# Altium project Phased_Array_Project.PrjPcb
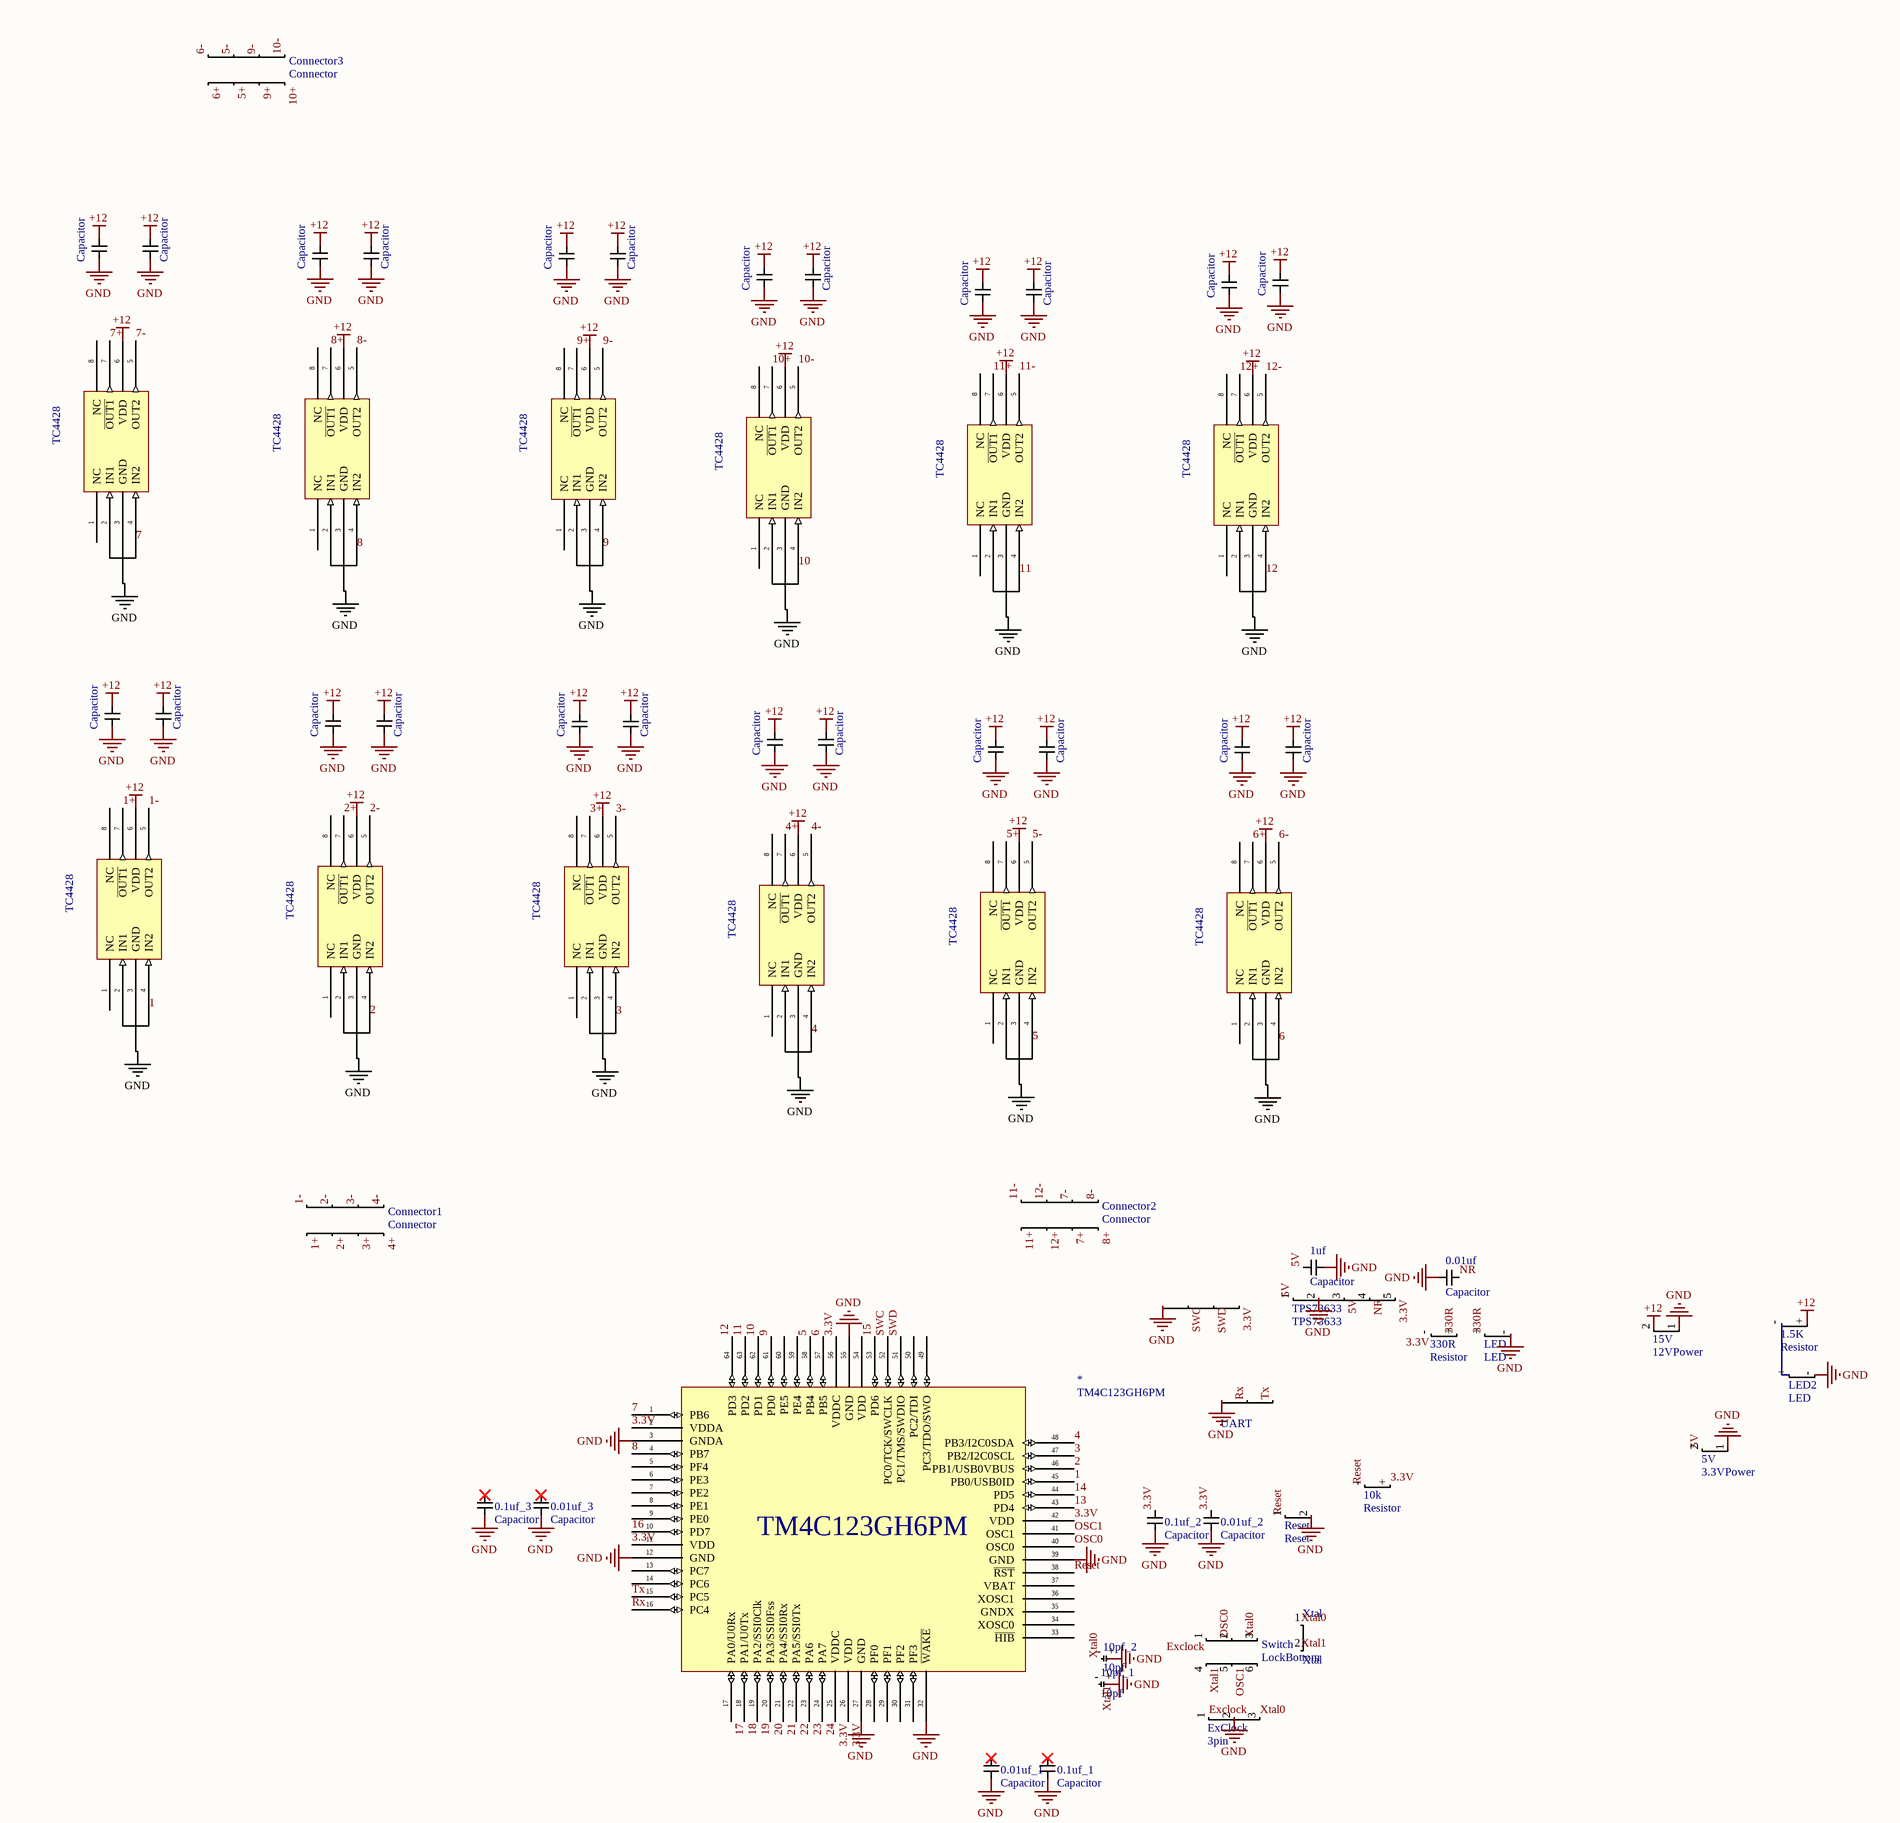
[diagram p0: Final Design.SchDoc, top]
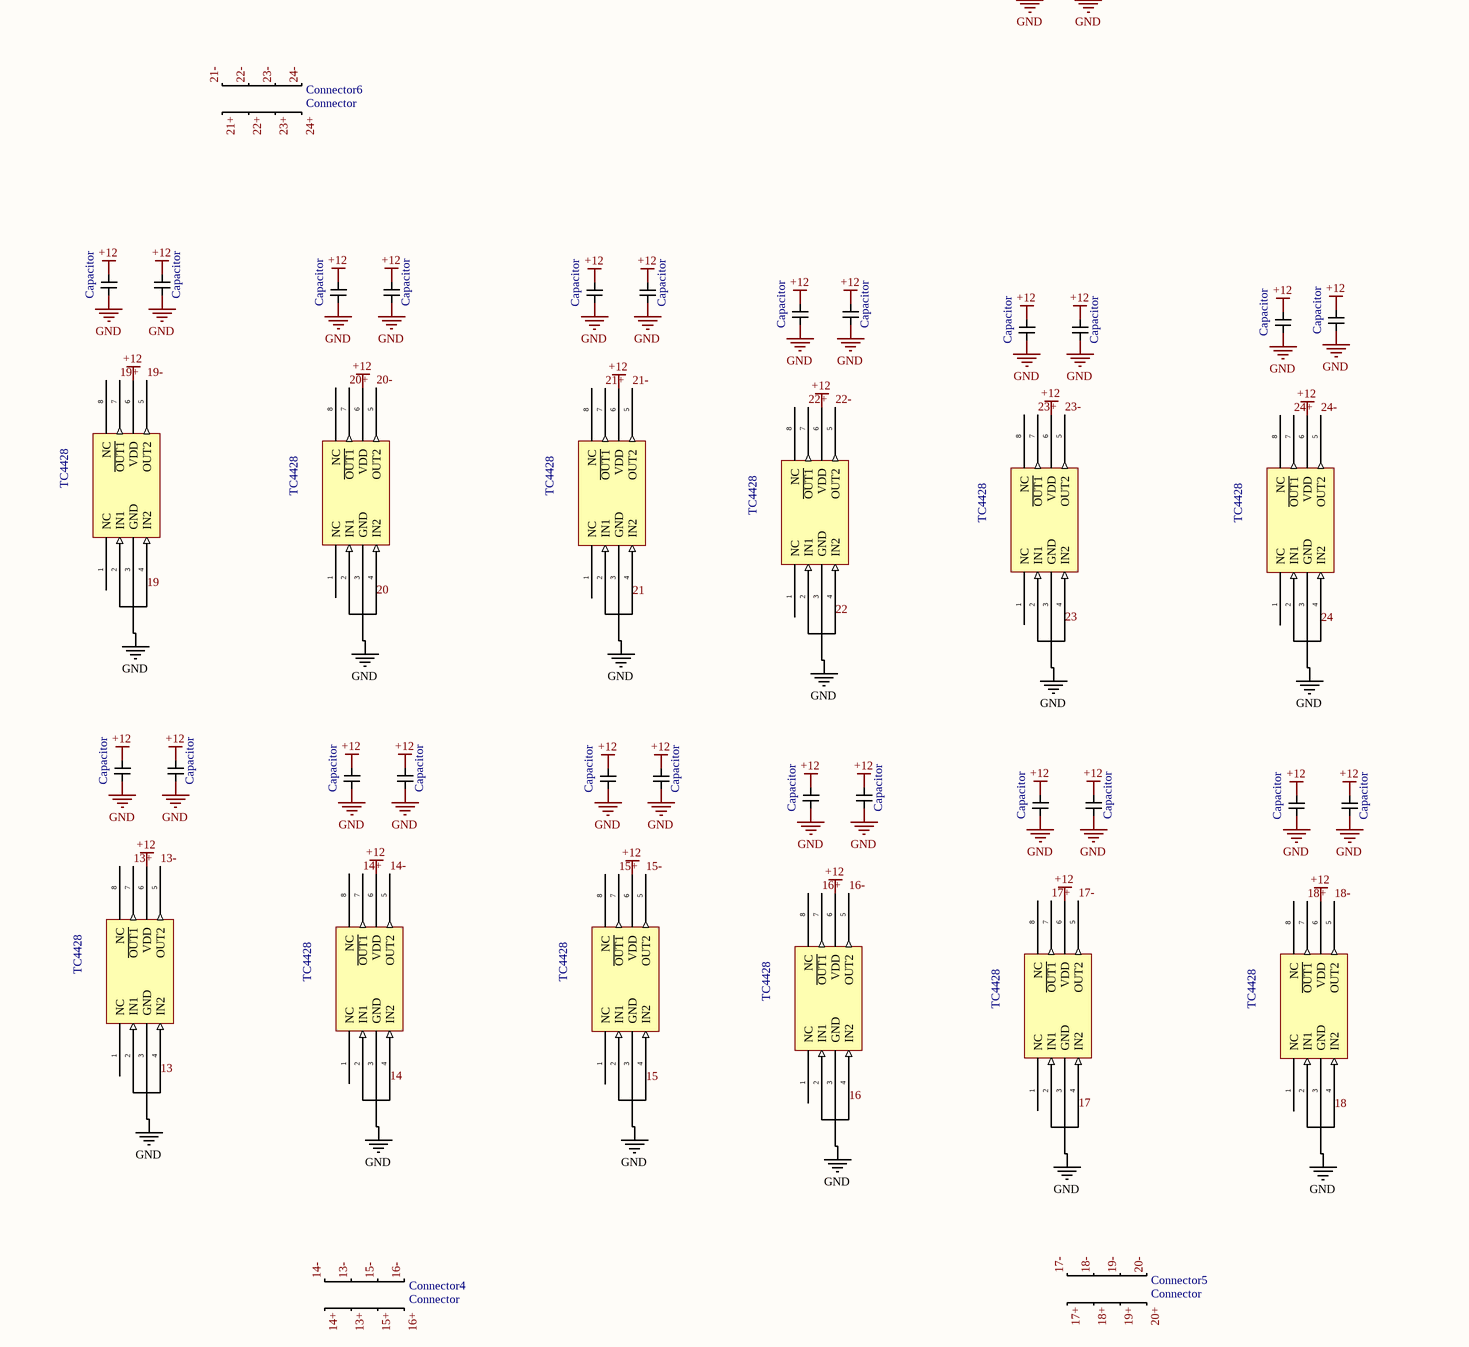
[diagram p1: Final Design.SchDoc, bottom]
1 sheet, 103 parts. Net scope: global (net labels, ports and power ports of the same name join across sheets).
Board file: PCB1.PcbDoc

## Sheet Final Design.SchDoc
size A0; Organization: Altium Limited; Address1: L3, 12a Rodborough Rd; Address2: Frenchs Forest; Address3: NSW; Address4: Australia 2086

### Parts
0.01uf  Capacitor  [0805]
0.01uf_1  Capacitor  [0805]
0.1uf_1  Capacitor  [0805]
0.1uf_2  Capacitor  [0805]
0.01uf_2  Capacitor  [0805]
0.1uf_3  Capacitor  [0805]
0.01uf_3  Capacitor  [0805]
1  TC4428  [TC4428SOC]
1.1  Capacitor  [0805]
1.2  Capacitor  [0805]
1.5K  Resistor  [0805]
1uf  Capacitor  [0805]
2  TC4428  [TC4428SOC]
2.1  Capacitor  [0805]
2.2  Capacitor  [0805]
3  TC4428  [TC4428SOC]
3.1  Capacitor  [0805]
3.2  Capacitor  [0805]
4  TC4428  [TC4428SOC]
4.1  Capacitor  [0805]
4.2  Capacitor  [0805]
5  TC4428  [TC4428SOC]
5.1  Capacitor  [0805]
5.2  Capacitor  [0805]
5V  3.3VPower  [DIP10]
6  TC4428  [TC4428SOC]
6.1  Capacitor  [0805]
6.2  Capacitor  [0805]
7  TC4428  [TC4428SOC]
7.1  Capacitor  [0805]
7.2  Capacitor  [0805]
8  TC4428  [TC4428SOC]
8.1  Capacitor  [0805]
8.2  Capacitor  [0805]
9  TC4428  [TC4428SOC]
9.1  Capacitor  [0805]
9.2  Capacitor  [0805]
10  TC4428  [TC4428SOC]
10.1  Capacitor  [0805]
10.2  Capacitor  [0805]
10k  Resistor  [0805]
10pf_1  10pf  [10pf]
10pf_2  10pf  [10pf]
11  TC4428  [TC4428SOC]
11.1  Capacitor  [0805]
11.2  Capacitor  [0805]
12  TC4428  [TC4428SOC]
12.1  Capacitor  [0805]
12.2  Capacitor  [0805]
13  TC4428  [TC4428SOC]
13.1  Capacitor  [0805]
13.2  Capacitor  [0805]
14  TC4428  [TC4428SOC]
14.1  Capacitor  [0805]
14.2  Capacitor  [0805]
15  TC4428  [TC4428SOC]
15.1  Capacitor  [0805]
15.2  Capacitor  [0805]
15V  12VPower  [DIP10]
16  TC4428  [TC4428SOC]
16.1  Capacitor  [0805]
16.2  Capacitor  [0805]
17  TC4428  [TC4428SOC]
17+  Capacitor  [0805]
17-  Capacitor  [0805]
18  TC4428  [TC4428SOC]
18.1  Capacitor  [0805]
18.2  Capacitor  [0805]
19  TC4428  [TC4428SOC]
19.1  Capacitor  [0805]
19.2  Capacitor  [0805]
20  TC4428  [TC4428SOC]
20.1  Capacitor  [0805]
20.2  Capacitor  [0805]
21  TC4428  [TC4428SOC]
21.1  Capacitor  [0805]
21.2  Capacitor  [0805]
22  TC4428  [TC4428SOC]
22.1  Capacitor  [0805]
22.2  Capacitor  [0805]
23  TC4428  [TC4428SOC]
23.1  Capacitor  [0805]
23.2  Capacitor  [0805]
24  TC4428  [TC4428SOC]
24.1  Capacitor  [0805]
24.2  Capacitor  [0805]
330R  Resistor  [0805]
*  TM4C123GH6PM  [Quad64 - duplicate]
Connector1  Connector  [Connector]
Connector2  Connector  [Connector]
Connector3  Connector  [Connector]
Connector4  Connector  [Connector]
Connector5  Connector  [Connector]
Connector6  Connector  [Connector]
ExClock  3pin  [3pin]
JTAG  JTAG  [JTAG - duplicate]  (value not drawn)
LED  LED  [0805]
LED2  LED  [0805]
Reset  Reset  [Reset]
Switch  LockBottom  [Lock]
TPS73633  TPS73633  [3.3v]
UART  UART  [UART]
Xtal  Xtal  [Crystal]

### Nets
+12: 1.6(VDD) 1.1.+ 1.2.+ 1.5K.+ 2.6(VDD) 2.1.+ 2.2.+ 3.6(VDD) 3.1.+ 3.2.+ 4.6(VDD) 4.1.+ 4.2.+ 5.6(VDD) 5.1.+ 5.2.+ 6.6(VDD) 6.1.+ 6.2.+ 7.6(VDD) 7.1.+ 7.2.+ 8.6(VDD) 8.1.+ 8.2.+ 9.6(VDD) 9.1.+ 9.2.+ 10.6(VDD) 10.1.+ 10.2.+ 11.6(VDD) 11.1.+ 11.2.+ 12.6(VDD) 12.1.+ 12.2.+ 13.6(VDD) 13.1.+ 13.2.+ 14.6(VDD) 14.1.+ 14.2.+ 15.6(VDD) 15.1.+ 15.2.+ 15V.2 16.6(VDD) 16.1.+ 16.2.+ 17.6(VDD) 17+.+ 17-.+ 18.6(VDD) 18.1.+ 18.2.+ 19.6(VDD) 19.1.+ 19.2.+ 20.6(VDD) 20.1.+ 20.2.+ 21.6(VDD) 21.1.+ 21.2.+ 22.6(VDD) 22.1.+ 22.2.+ 23.6(VDD) 23.1.+ 23.2.+ 24.6(VDD) 24.1.+ 24.2.+
GND: 0.01uf.- 0.01uf_1.- 0.1uf_1.- 0.1uf_2.- 0.01uf_2.- 0.1uf_3.- 0.01uf_3.- 1.3(GND) 1.1.- 1.2.- 1uf.+ 2.3(GND) 2.1.- 2.2.- 3.3(GND) 3.1.- 3.2.- 4.3(GND) 4.1.- 4.2.- 5.3(GND) 5.1.- 5.2.- 5V.1 6.3(GND) 6.1.- 6.2.- 7.3(GND) 7.1.- 7.2.- 8.3(GND) 8.1.- 8.2.- 9.3(GND) 9.1.- 9.2.- 10.3(GND) 10.1.- 10.2.- 10pf_1.+ 10pf_2.+ 11.3(GND) 11.1.- 11.2.- 12.3(GND) 12.1.- 12.2.- 13.3(GND) 13.1.- 13.2.- 14.3(GND) 14.1.- 14.2.- 15.3(GND) 15.1.- 15.2.- 15V.1 16.3(GND) 16.1.- 16.2.- 17.3(GND) 17+.- 17-.- 18.3(GND) 18.1.- 18.2.- 19.3(GND) 19.1.- 19.2.- 20.3(GND) 20.1.- 20.2.- 21.3(GND) 21.1.- 21.2.- 22.3(GND) 22.1.- 22.2.- 23.3(GND) 23.1.- 23.2.- 24.3(GND) 24.1.- 24.2.- *.3(GNDA) *.12(GND) *.27(GND) *.32(~{WAKE}) *.39(GND) *.55(GND) ExClock.2 JTAG.GND LED.- LED2.- Reset.2 TPS73633.2 UART.GND
1: 1.2(IN1) 1.4(IN2) *.45(PB0/USB0ID)
1+: 1.7(~{OUT1}) Connector1.1
1-: 1.5(OUT2) Connector1.8
2: 2.2(IN1) 2.4(IN2) *.46(PB1/USB0VBUS)
2+: 2.7(~{OUT1}) Connector1.2
2-: 2.5(OUT2) Connector1.7
3: 3.2(IN1) 3.4(IN2) *.47(PB2/I2C0SCL)
3+: 3.7(~{OUT1}) Connector1.3
3-: 3.5(OUT2) Connector1.6
3.3V: 0.1uf_2.+ 0.01uf_2.+ 10k.+ 330R.- *.2(VDDA) *.11(VDD) *.25(VDDC) *.26(VDD) *.42(VDD) *.56(VDDC) JTAG.3.3V TPS73633.5
4: 4.2(IN1) 4.4(IN2) *.48(PB3/I2C0SDA)
4+: 4.7(~{OUT1}) Connector1.4
4-: 4.5(OUT2) Connector1.5
5: 5.2(IN1) 5.4(IN2) *.58(PB4)
5+: 5.7(~{OUT1}) Connector3.2
5-: 5.5(OUT2) Connector3.7
5V: 1uf.- 5V.2 TPS73633.1 TPS73633.3
6: 6.2(IN1) 6.4(IN2) *.57(PB5)
6+: 6.7(~{OUT1}) Connector3.1
6-: 6.5(OUT2) Connector3.8
7: 7.2(IN1) 7.4(IN2) *.1(PB6)
7+: 7.7(~{OUT1}) Connector2.3
7-: 7.5(OUT2) Connector2.6
8: 8.2(IN1) 8.4(IN2) *.4(PB7)
8+: 8.7(~{OUT1}) Connector2.4
8-: 8.5(OUT2) Connector2.5
9: 9.2(IN1) 9.4(IN2) *.61(PD0)
9+: 9.7(~{OUT1}) Connector3.3
9-: 9.5(OUT2) Connector3.6
10: 10.2(IN1) 10.4(IN2) *.62(PD1)
10+: 10.7(~{OUT1}) Connector3.4
10-: 10.5(OUT2) Connector3.5
11: 11.2(IN1) 11.4(IN2) *.63(PD2)
11+: 11.7(~{OUT1}) Connector2.1
11-: 11.5(OUT2) Connector2.8
12: 12.2(IN1) 12.4(IN2) *.64(PD3)
12+: 12.7(~{OUT1}) Connector2.2
12-: 12.5(OUT2) Connector2.7
13: 13.2(IN1) 13.4(IN2) *.43(PD4)
13+: 13.7(~{OUT1}) Connector4.2
13-: 13.5(OUT2) Connector4.7
14: 14.2(IN1) 14.4(IN2) *.44(PD5)
14+: 14.7(~{OUT1}) Connector4.1
14-: 14.5(OUT2) Connector4.8
15: 15.2(IN1) 15.4(IN2) *.53(PD6)
15+: 15.7(~{OUT1}) Connector4.3
15-: 15.5(OUT2) Connector4.6
16: 16.2(IN1) 16.4(IN2) *.10(PD7)
16+: 16.7(~{OUT1}) Connector4.4
16-: 16.5(OUT2) Connector4.5
17: 17.2(IN1) 17.4(IN2) *.17(PA0/U0Rx)
17+: 17.7(~{OUT1}) Connector5.1
17-: 17.5(OUT2) Connector5.8
18: 18.2(IN1) 18.4(IN2) *.18(PA1/U0Tx)
18+: 18.7(~{OUT1}) Connector5.2
18-: 18.5(OUT2) Connector5.7
19: 19.2(IN1) 19.4(IN2) *.19(PA2/SSI0Clk)
19+: 19.7(~{OUT1}) Connector5.3
19-: 19.5(OUT2) Connector5.6
20: 20.2(IN1) 20.4(IN2) *.20(PA3/SSI0Fss)
20+: 20.7(~{OUT1}) Connector5.4
20-: 20.5(OUT2) Connector5.5
21: 21.2(IN1) 21.4(IN2) *.21(PA4/SSI0Rx)
21+: 21.7(~{OUT1}) Connector6.1
21-: 21.5(OUT2) Connector6.8
22: 22.2(IN1) 22.4(IN2) *.22(PA5/SSI0Tx)
22+: 22.7(~{OUT1}) Connector6.2
22-: 22.5(OUT2) Connector6.7
23: 23.2(IN1) 23.4(IN2) *.23(PA6)
23+: 23.7(~{OUT1}) Connector6.3
23-: 23.5(OUT2) Connector6.6
24: 24.2(IN1) 24.4(IN2) *.24(PA7)
24+: 24.7(~{OUT1}) Connector6.4
24-: 24.5(OUT2) Connector6.5
330R: 330R.+ LED.+
Exclock: ExClock.1 Switch.1
NR: 0.01uf.+ TPS73633.4
OSC0: *.40(OSC0) Switch.2
OSC1: *.41(OSC1) Switch.5
Reset: 10k.- *.38(~{RST}) Reset.1
Rx: *.16(PC4) UART.TX
SWC: *.52(PC0/TCK/SWCLK) JTAG.SWC
SWD: *.51(PC1/TMS/SWDIO) JTAG.SWD
Tx: *.15(PC5) UART.RX
Xtal0: 10pf_2.- ExClock.3 Switch.3 Xtal.1
Xtal1: 10pf_1.- Switch.4 Xtal.2
Net1.5K_-: 1.5K.- LED2.+

Not connected (* = marked no-connect by the designer): 0.01uf_1 +*; 0.1uf_1 +*; 0.1uf_3 +*; 0.01uf_3 +*; 1 1(NC) 8(NC); 2 1(NC) 8(NC); 3 1(NC) 8(NC); 4 1(NC) 8(NC); 5 1(NC) 8(NC); 6 1(NC) 8(NC); 7 1(NC) 8(NC); 8 1(NC) 8(NC); 9 1(NC) 8(NC); 10 1(NC) 8(NC); 11 1(NC) 8(NC); 12 1(NC) 8(NC); 13 1(NC) 8(NC); 14 1(NC) 8(NC); 15 1(NC) 8(NC); 16 1(NC) 8(NC); 17 1(NC) 8(NC); 18 1(NC) 8(NC); 19 1(NC) 8(NC); 20 1(NC) 8(NC); 21 1(NC) 8(NC); 22 1(NC) 8(NC); 23 1(NC) 8(NC); 24 1(NC) 8(NC); * 5(PF4) 6(PE3) 7(PE2) 8(PE1) 9(PE0) 13(PC7) 14(PC6) 28(PF0) 29(PF1) 30(PF2) 31(PF3) 33(~{HIB}) 34(XOSC0) 35(GNDX) 36(XOSC1) 37(VBAT) 49(PC3/TDO/SWO) 50(PC2/TDI) 54(VDD) 59(PE4) 60(PE5); Switch 6

### Notes on the sheet
- Title
- Size:
- Date:
- File:
- A0
- Number:
- Time:
- Revision:
- Sheet
- of

### Library data of the parts
0.01uf 0.01uf_1 0.1uf_1 0.1uf_2 0.01uf_2 0.1uf_3 0.01uf_3 1.1 1.2 1uf 2.1 2.2 3.1 3.2 4.1 4.2 5.1 5.2 6.1 6.2 7.1 7.2 8.1 8.2 9.1 9.2 10.1 10.2 11.1 11.2 12.1 12.2 13.1 13.2 14.1 14.2 15.1 15.2 16.1 16.2 17+ 17- 18.1 18.2 19.1 19.2 20.1 20.2 21.1 21.2 22.1 22.2 23.1 23.2 24.1 24.2 = Capacitor: pin to pad: +>1 ->2
1-24 = TC4428: Dual High-Speed Power MOSFET Drivers
1.5K 10k 330R = Resistor: pin to pad: +>2 ->1
10pf_1 10pf_2 = 10pf: pin to pad: +>2 ->1
* = TM4C123GH6PM: IC MCU 32BIT 256KB FLASH 64LQFP
LED LED2 = LED: pin to pad: +>1 ->2
TPS73633 = TPS73633: pin to pad: 5>6